# Altium schematic sheet Connector.SchDoc: DfMUX Mezzanine Connector
size Letter; ProjectTitle: Dan DfMux Mezz; ModelNumber: MGMEZZ04
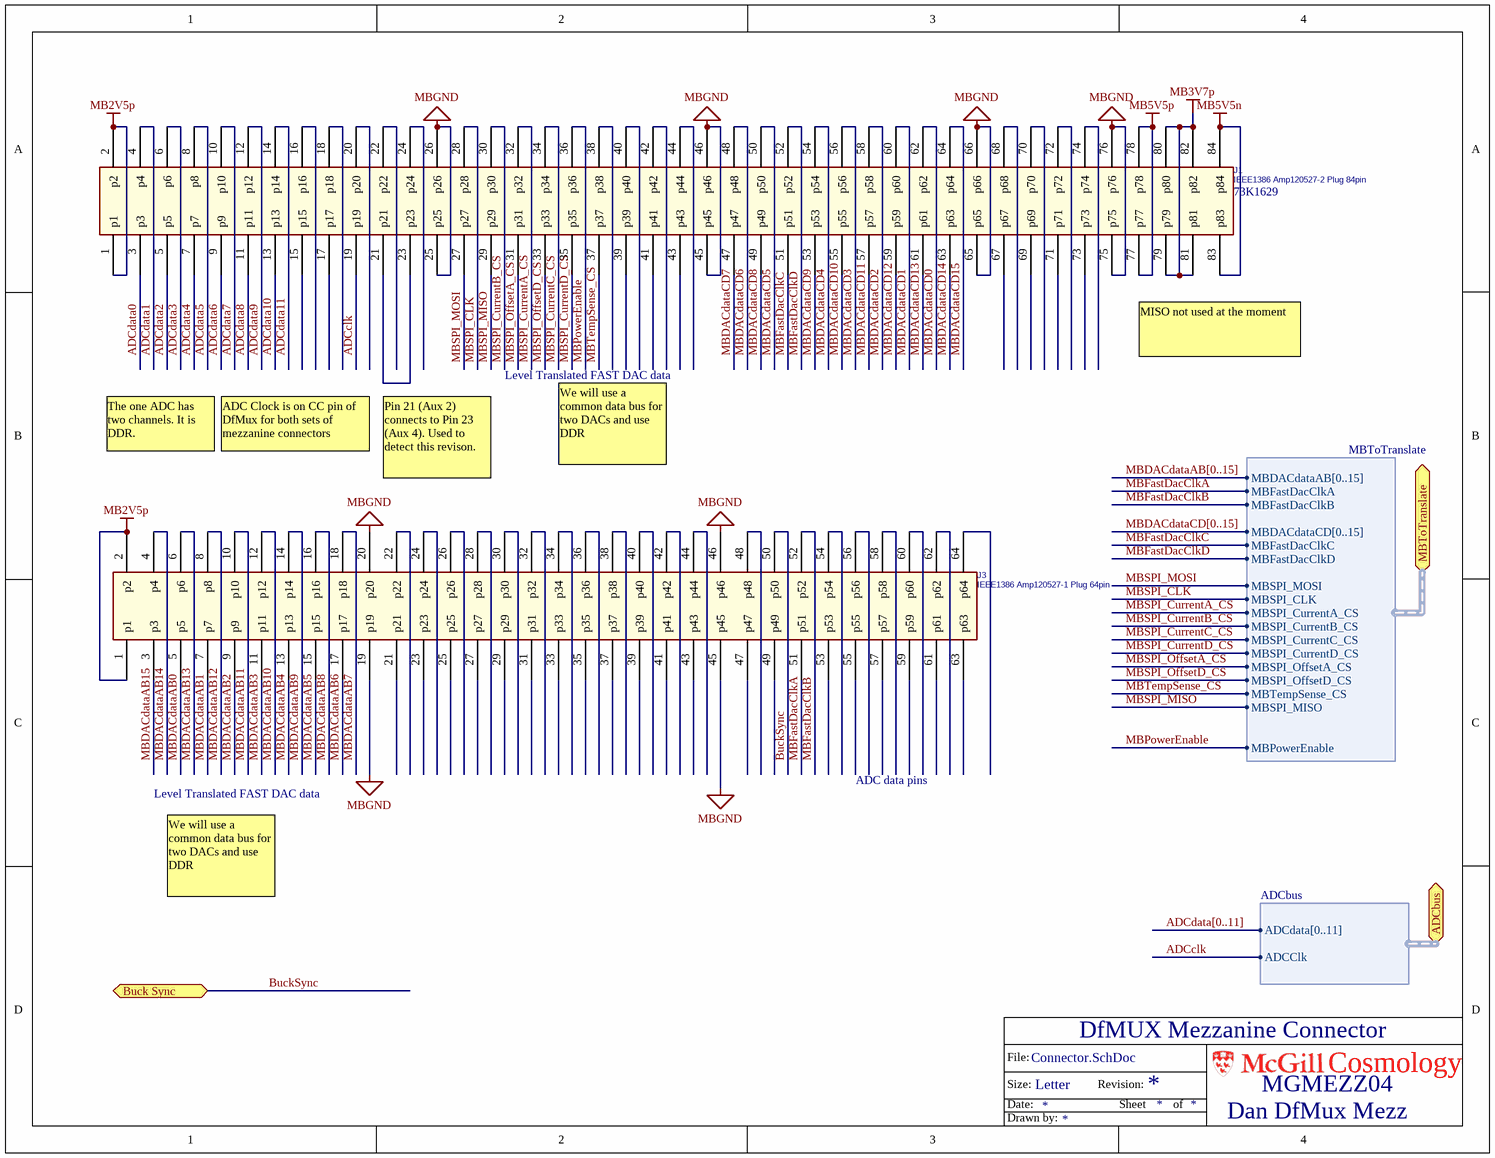
[diagram p0: Connector.SchDoc]

## Parts
J1  IEEE1386 Amp120527-2 Plug 84pin  Supplier Part Number 1: 73K1629  [CON_AMP_1MM_84PINS]
J3  IEEE1386 Amp120527-1 Plug 64pin  [CON_AMP_1MM_64PINS]

## Ports
ADCbus (harness ADCbus), Buck Sync, MBToTranslate (harness MBToTranslate)

## Harnesses
ADCbus: ADCdata[0..11], ADCClk
MBToTranslate: MBDACdataAB[0..15], MBFastDacClkA, MBSPI_MOSI, MBSPI_CLK, MBFastDacClkB, MBFastDacClkC, MBFastDacClkD, MBDACdataCD[0..15], MBPowerEnable, MBSPI_CurrentA_CS, MBSPI_CurrentB_CS, MBSPI_CurrentC_CS, MBSPI_CurrentD_CS, MBSPI_OffsetA_CS, MBSPI_OffsetD_CS, MBTempSense_CS, MBSPI_MISO

## Nets
MB2V5p: J1.1(p1) J1.2(p2) J3.1(p1) J3.2(p2)
MB3V7p: J1.79(p79) J1.80(p80) J1.81(p81) J1.82(p82)
MB5V5n: J1.83(p83) J1.84(p84)
MB5V5p: J1.77(p77) J1.78(p78)
MBGND: J1.25(p25) J1.26(p26) J1.45(p45) J1.46(p46) J1.65(p65) J1.66(p66) J1.75(p75) J1.76(p76) J3.19(p19) J3.20(p20) J3.45(p45) J3.46(p46)
ADCclk: J1.19(p19) ; port ADCbus.ADCClk
ADCdata0: J1.3(p3)
ADCdata1: J1.4(p4)
ADCdata2: J1.5(p5)
ADCdata3: J1.6(p6)
ADCdata4: J1.7(p7)
ADCdata5: J1.8(p8)
ADCdata6: J1.9(p9)
ADCdata7: J1.10(p10)
ADCdata8: J1.11(p11)
ADCdata9: J1.12(p12)
ADCdata10: J1.13(p13)
ADCdata11: J1.14(p14)
BuckSync: J3.50(p50) ; port Buck Sync
MBDACdataAB0: J3.5(p5)
MBDACdataAB1: J3.7(p7)
MBDACdataAB2: J3.9(p9)
MBDACdataAB3: J3.11(p11)
MBDACdataAB4: J3.13(p13)
MBDACdataAB5: J3.15(p15)
MBDACdataAB6: J3.17(p17)
MBDACdataAB7: J3.18(p18)
MBDACdataAB8: J3.16(p16)
MBDACdataAB9: J3.14(p14)
MBDACdataAB10: J3.12(p12)
MBDACdataAB11: J3.10(p10)
MBDACdataAB12: J3.8(p8)
MBDACdataAB13: J3.6(p6)
MBDACdataAB14: J3.4(p4)
MBDACdataAB15: J3.3(p3)
MBDACdataCD0: J1.62(p62)
MBDACdataCD1: J1.60(p60)
MBDACdataCD2: J1.58(p58)
MBDACdataCD3: J1.56(p56)
MBDACdataCD4: J1.54(p54)
MBDACdataCD5: J1.50(p50)
MBDACdataCD6: J1.48(p48)
MBDACdataCD7: J1.47(p47)
MBDACdataCD8: J1.49(p49)
MBDACdataCD9: J1.53(p53)
MBDACdataCD10: J1.55(p55)
MBDACdataCD11: J1.57(p57)
MBDACdataCD12: J1.59(p59)
MBDACdataCD13: J1.61(p61)
MBDACdataCD14: J1.63(p63)
MBDACdataCD15: J1.64(p64)
MBFastDacClkA: J3.51(p51) ; port MBToTranslate.MBFastDacClkA
MBFastDacClkB: J3.52(p52) ; port MBToTranslate.MBFastDacClkB
MBFastDacClkC: J1.51(p51) ; port MBToTranslate.MBFastDacClkC
MBFastDacClkD: J1.52(p52) ; port MBToTranslate.MBFastDacClkD
MBPowerEnable: J1.36(p36) ; port MBToTranslate.MBPowerEnable
MBSPI_CLK: J1.28(p28) ; port MBToTranslate.MBSPI_CLK
MBSPI_CurrentA_CS: J1.32(p32) ; port MBToTranslate.MBSPI_CurrentA_CS
MBSPI_CurrentB_CS: J1.30(p30) ; port MBToTranslate.MBSPI_CurrentB_CS
MBSPI_CurrentC_CS: J1.34(p34) ; port MBToTranslate.MBSPI_CurrentC_CS
MBSPI_CurrentD_CS: J1.35(p35) ; port MBToTranslate.MBSPI_CurrentD_CS
MBSPI_MISO: J1.29(p29) ; port MBToTranslate.MBSPI_MISO
MBSPI_MOSI: J1.27(p27) ; port MBToTranslate.MBSPI_MOSI
MBSPI_OffsetA_CS: J1.31(p31) ; port MBToTranslate.MBSPI_OffsetA_CS
MBSPI_OffsetD_CS: J1.33(p33) ; port MBToTranslate.MBSPI_OffsetD_CS
MBTempSense_CS: J1.37(p37) ; port MBToTranslate.MBTempSense_CS
NetJ1_21: J1.21(p21) J1.23(p23)

Not connected (* = marked no-connect by the designer): J1 15(p15) 16(p16) 17(p17) 18(p18) 20(p20) 22(p22) 24(p24) 38(p38) 39(p39) 40(p40) 41(p41) 42(p42) 43(p43) 44(p44) 67(p67) 68(p68) 69(p69) 70(p70) 71(p71) 72(p72) 73(p73) 74(p74); J3 21(p21) 22(p22) 23(p23) 24(p24) 25(p25) 26(p26) 27(p27) 28(p28) 29(p29) 30(p30) 31(p31) 32(p32) 33(p33) 34(p34) 35(p35) 36(p36) 37(p37) 38(p38) 39(p39) 40(p40) 41(p41) 42(p42) 43(p43) 44(p44) 47(p47) 48(p48) 49(p49) 53(p53) 54(p54) 55(p55) 56(p56) 57(p57) 58(p58) 59(p59) 60(p60) 61(p61) 62(p62) 63(p63) 64(p64)

## Buses and harness runs
bus ADCdata[0..11]
bus MBDACdataAB[0..15]
bus MBDACdataCD[0..15]

## Notes on the sheet
- MISO not used at the moment
- Level Translated FAST DAC data
- The one ADC has two channels. It is DDR.
- ADC Clock is on CC pin of DfMux for both sets of mezzanine connectors
- Pin 21 (Aux 2) connects to Pin 23 (Aux 4). Used to detect this revison.
- We will use a common data bus for two DACs and use DDR
- ADC data pins
- File:
- Size:
- Date:
- Letter
- Revision:
- Sheet
- of
- Cosmology
- Drawn by:

## Library data of the parts
J1 = IEEE1386 Amp120527-2 Plug84pin: Part Constraints: 5120527-2; Manufacturer: TE CONNECTIVITY / AMP; Assembly Comments: none; Type: Connector; Supplier 1: Newark; Manufacturers Part Number: 5120527-2
J3 = IEEE1386 Amp120527-1 Plug 64pin: Manufacturer: TE Connectivity; Assembly Comments: none; Supplier 1: Digi-Key; Supplier Part Number 1: 120527-1-ND; Part Constraints: 120527-1; Manufacturers Part Number: 120527-1; Type: Connector